# EAGLE design BotBoardUSBMotor-R1 (EAGLE 4.16)
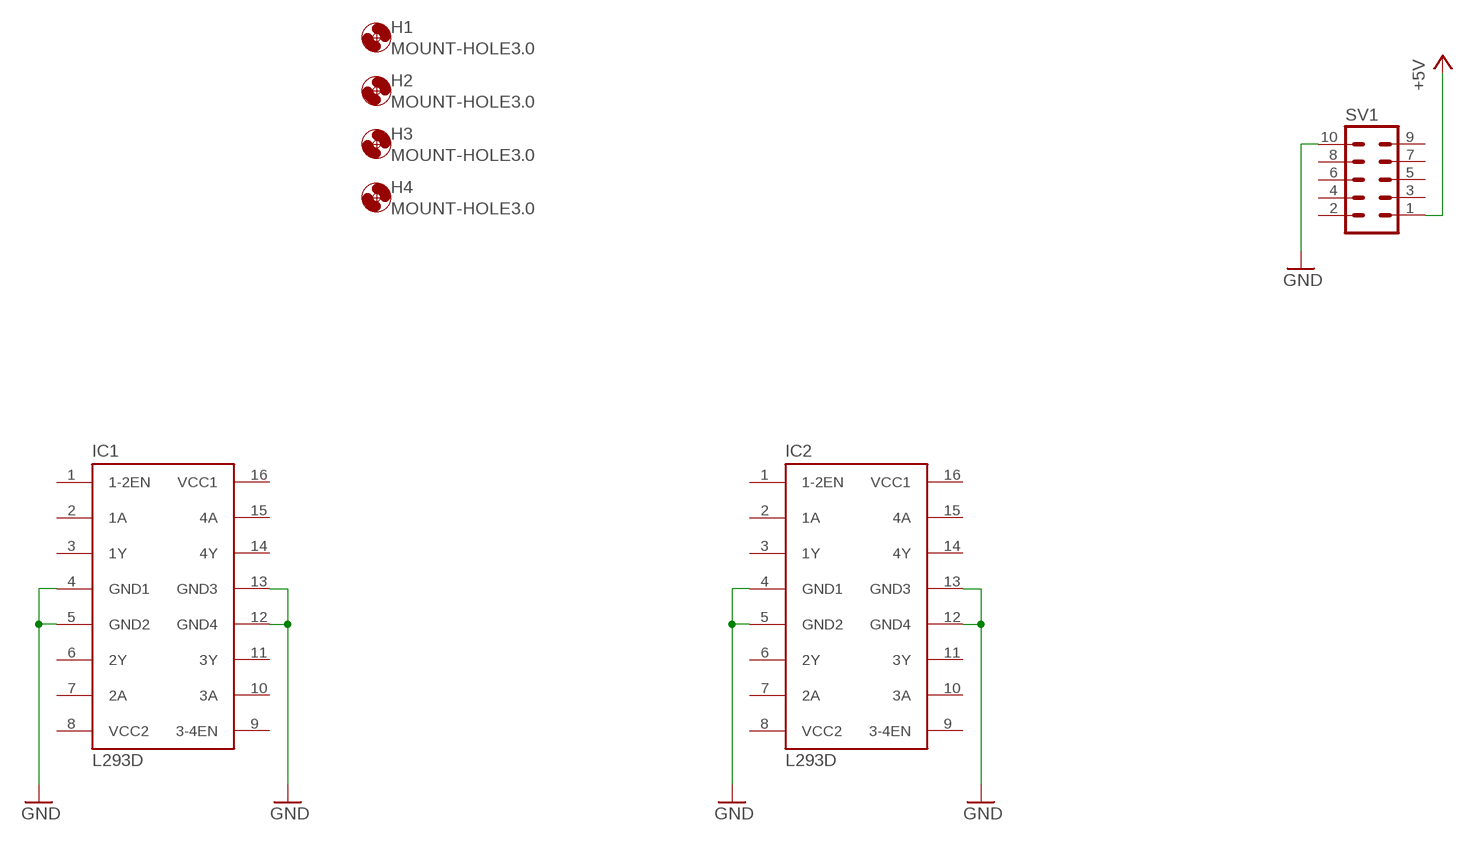
[diagram p0: schematic, sheet 1]

## Parts
H1  MOUNT-HOLE3.0  [3,0]
H2  MOUNT-HOLE3.0  [3,0]
H3  MOUNT-HOLE3.0  [3,0]
H4  MOUNT-HOLE3.0  [3,0]
IC1  L293D  [DIL16]
IC2  L293D  [DIL16]
SV1  ML10  [ML10]

## Nets
+5V: SV1.1
GND: IC1.4(GND1) IC1.5(GND2) IC1.12(GND4) IC1.13(GND3) IC2.4(GND1) IC2.5(GND2) IC2.12(GND4) IC2.13(GND3) SV1.10
Unconnected: IC1.1(1-2EN) IC1.2(1A) IC1.3(1Y) IC1.6(2Y) IC1.7(2A) IC1.9(3-4EN) IC1.10(3A) IC1.11(3Y) IC1.14(4Y) IC1.15(4A) IC2.1(1-2EN) IC2.2(1A) IC2.3(1Y) IC2.6(2Y) IC2.7(2A) IC2.9(3-4EN) IC2.10(3A) IC2.11(3Y) IC2.14(4Y) IC2.15(4A) SV1.2 SV1.3 SV1.4 SV1.5 SV1.6 SV1.7 SV1.8 SV1.9

## Power pins joined to a net without a drawn wire
VCC1: IC1.16(VCC1) IC2.16(VCC1)
VCC2: IC1.8(VCC2) IC2.8(VCC2)

## Library data of the parts
H1-H4 = holes:MOUNT-HOLE: MOUNTING HOLE with drill center marker
IC1 IC2 = st-microelectronics:L293D: PUSH-PULL 4 CHANNEL DRIVER
SV1 = con-harting-ml:ML10: HARTING

## Board
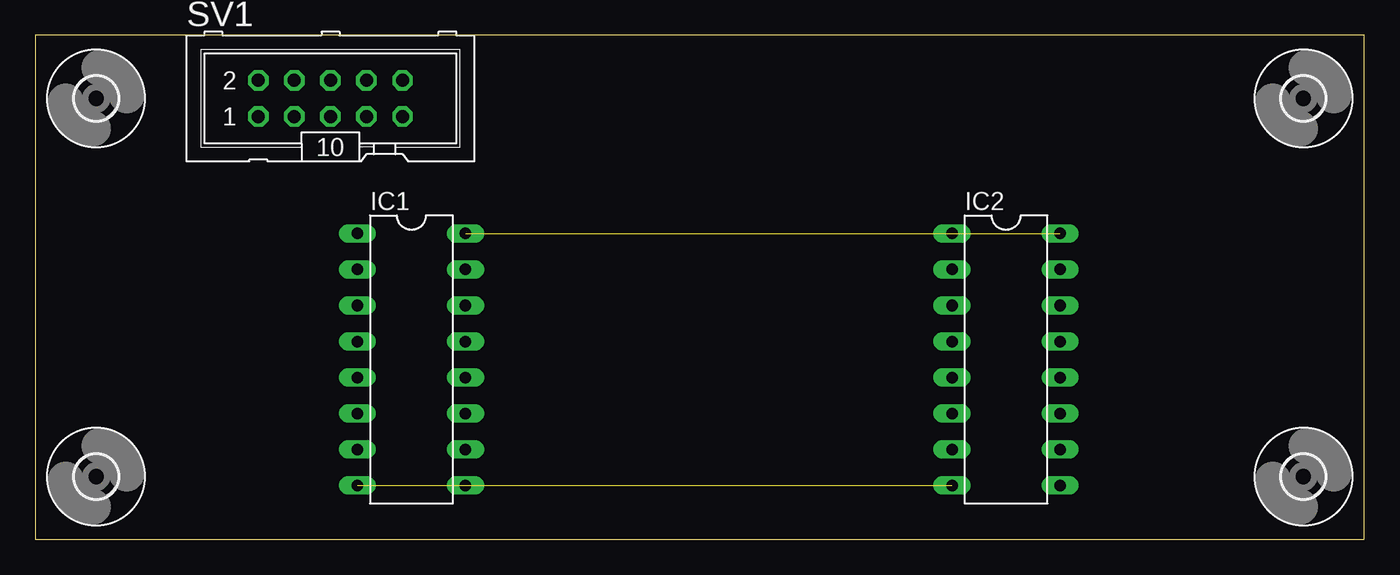
[diagram p1: board, top side]
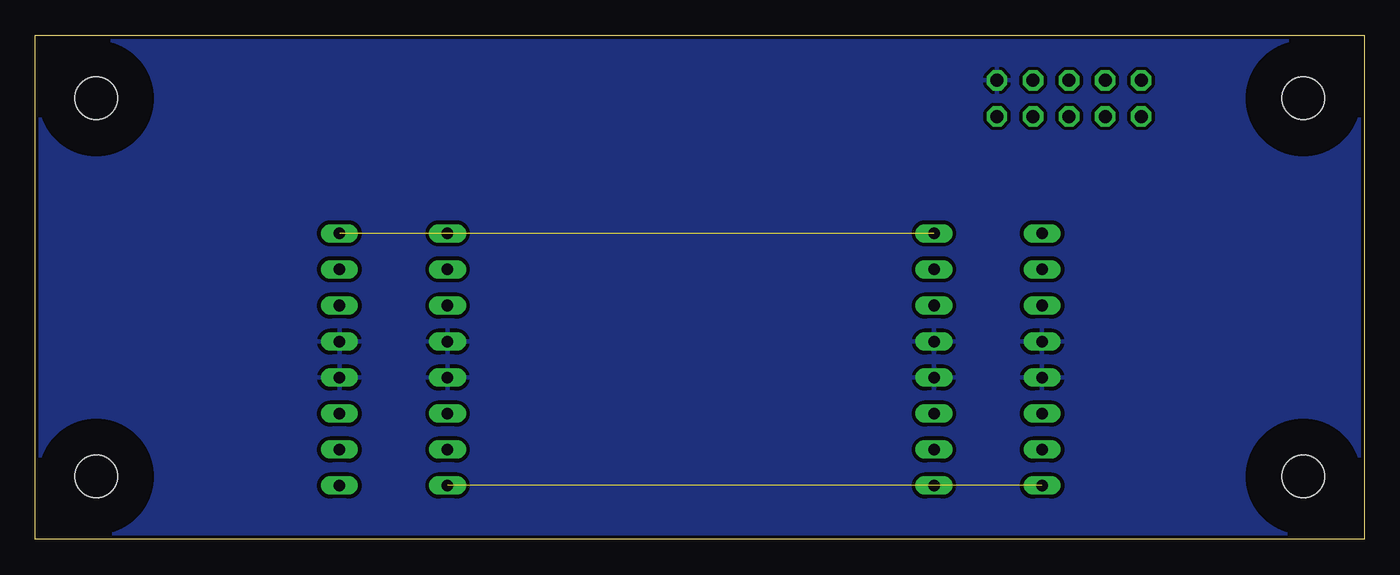
[diagram p2: board, bottom side, seen from below]

Size 93.65 x 35.55 mm. Coordinates in mm from the lower left corner, seen from the top.
Outline: 0,0 93.65,0 93.65,35.55 0,35.55 0,0
Copper layers (1*16): Top 0.035mm / dielectric 1.5mm / Bottom 0.035mm
Design rules "default": minimum track width 10mil, minimum drill 24mil, track to track 10mil, track to pad 10mil, pad to pad 10mil, via to via 10mil, smd to smd 10mil, copper to edge 10mil, drill to drill 8mil, minimum pad ring 10mil, minimum via ring 8mil, stop-mask expansion 4mil, vias tented up to drill 0mil, thermal gap 10mil

### Footprints (pad centres in the part's own frame; a part is rotated, then mirrored left to right if it is on the bottom)
3,0 = hole 3: 0,0
DIL16 = drill 0.813 long: 1 -8.89,-3.81; 2 -6.35,-3.81; 3 -3.81,-3.81; 4 -1.27,-3.81; 5 1.27,-3.81; 6 3.81,-3.81; 7 6.35,-3.81; 8 8.89,-3.81; 9 8.89,3.81; 10 6.35,3.81; 11 3.81,3.81; 12 1.27,3.81; 13 -1.27,3.81; 14 -3.81,3.81; 15 -6.35,3.81; 16 -8.89,3.81
ML10 = drill 0.914 octagon: 1 -5.08,-1.27; 2 -5.08,1.27; 3 -2.54,-1.27; 4 -2.54,1.27; 5 0,-1.27; 6 0,1.27; 7 2.54,-1.27; 8 2.54,1.27; 9 5.08,-1.27; 10 5.08,1.27

### Placement (x,y rotation side)
H1  89.37,4.44 0 top
H2  4.28,4.44 0 top
H3  89.37,31.11 0 top
H4  4.28,31.11 0 top
IC1  26.51,12.69 270 top
IC2  68.41,12.69 270 top
SV1  20.79,31.11 0 top

### Tracks (layer width: path | path; a pad name or v marks a point on that pad's centre or on a via)
GND
  pour Bottom: -1.44,35.55 -1.44,-1.27 95.08,-1.27 95.08,36.82 -1.44,36.82
VCC1  (1 unrouted)
VCC2  (1 unrouted)